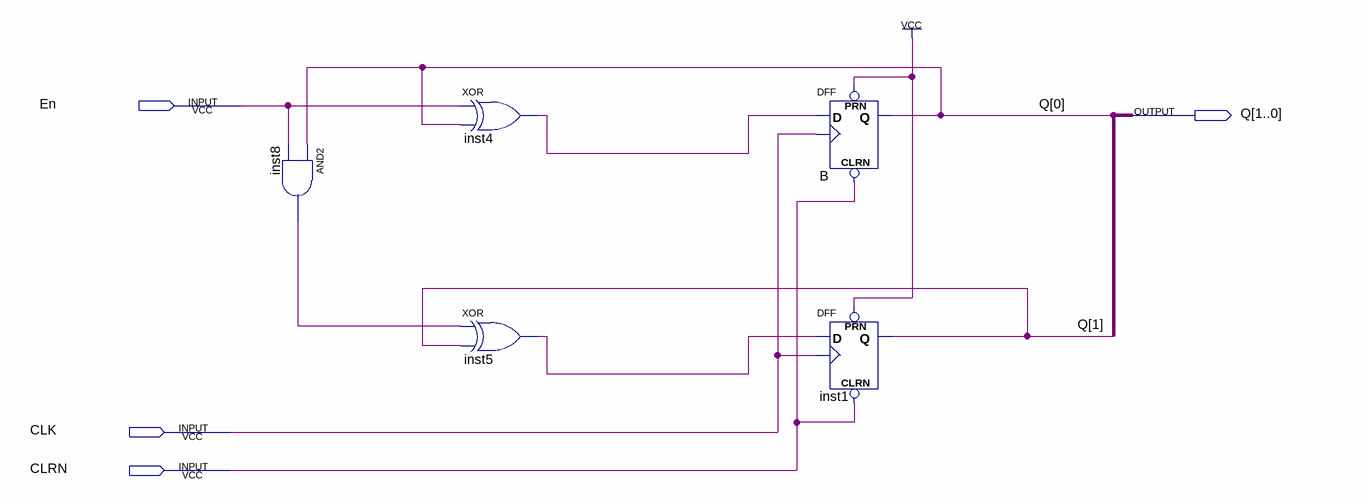
[diagram p0: schematic sheet]
// Quartus schematic two_bit_counter.bdf as structural Verilog: 5 symbols, 4 pins
module two_bit_counter (
  input  En,
  input  CLK,
  input  CLRN,
  output [1:0] Q
);

  wire inst4_out, inst5_out, inst8_out;

  and inst8 (inst8_out, Q[0], En);
  xor inst4 (inst4_out, En, Q[0]);
  xor inst5 (inst5_out, inst8_out, Q[1]);
  DFF B (.CLRN(CLRN), .CLK(CLK), .D(inst4_out), .PRN(1'b1), .Q(Q[0]));
  DFF inst1 (.CLRN(CLRN), .CLK(CLK), .D(inst5_out), .PRN(1'b1), .Q(Q[1]));
endmodule
